# EAGLE design working (EAGLE 6.5.0)
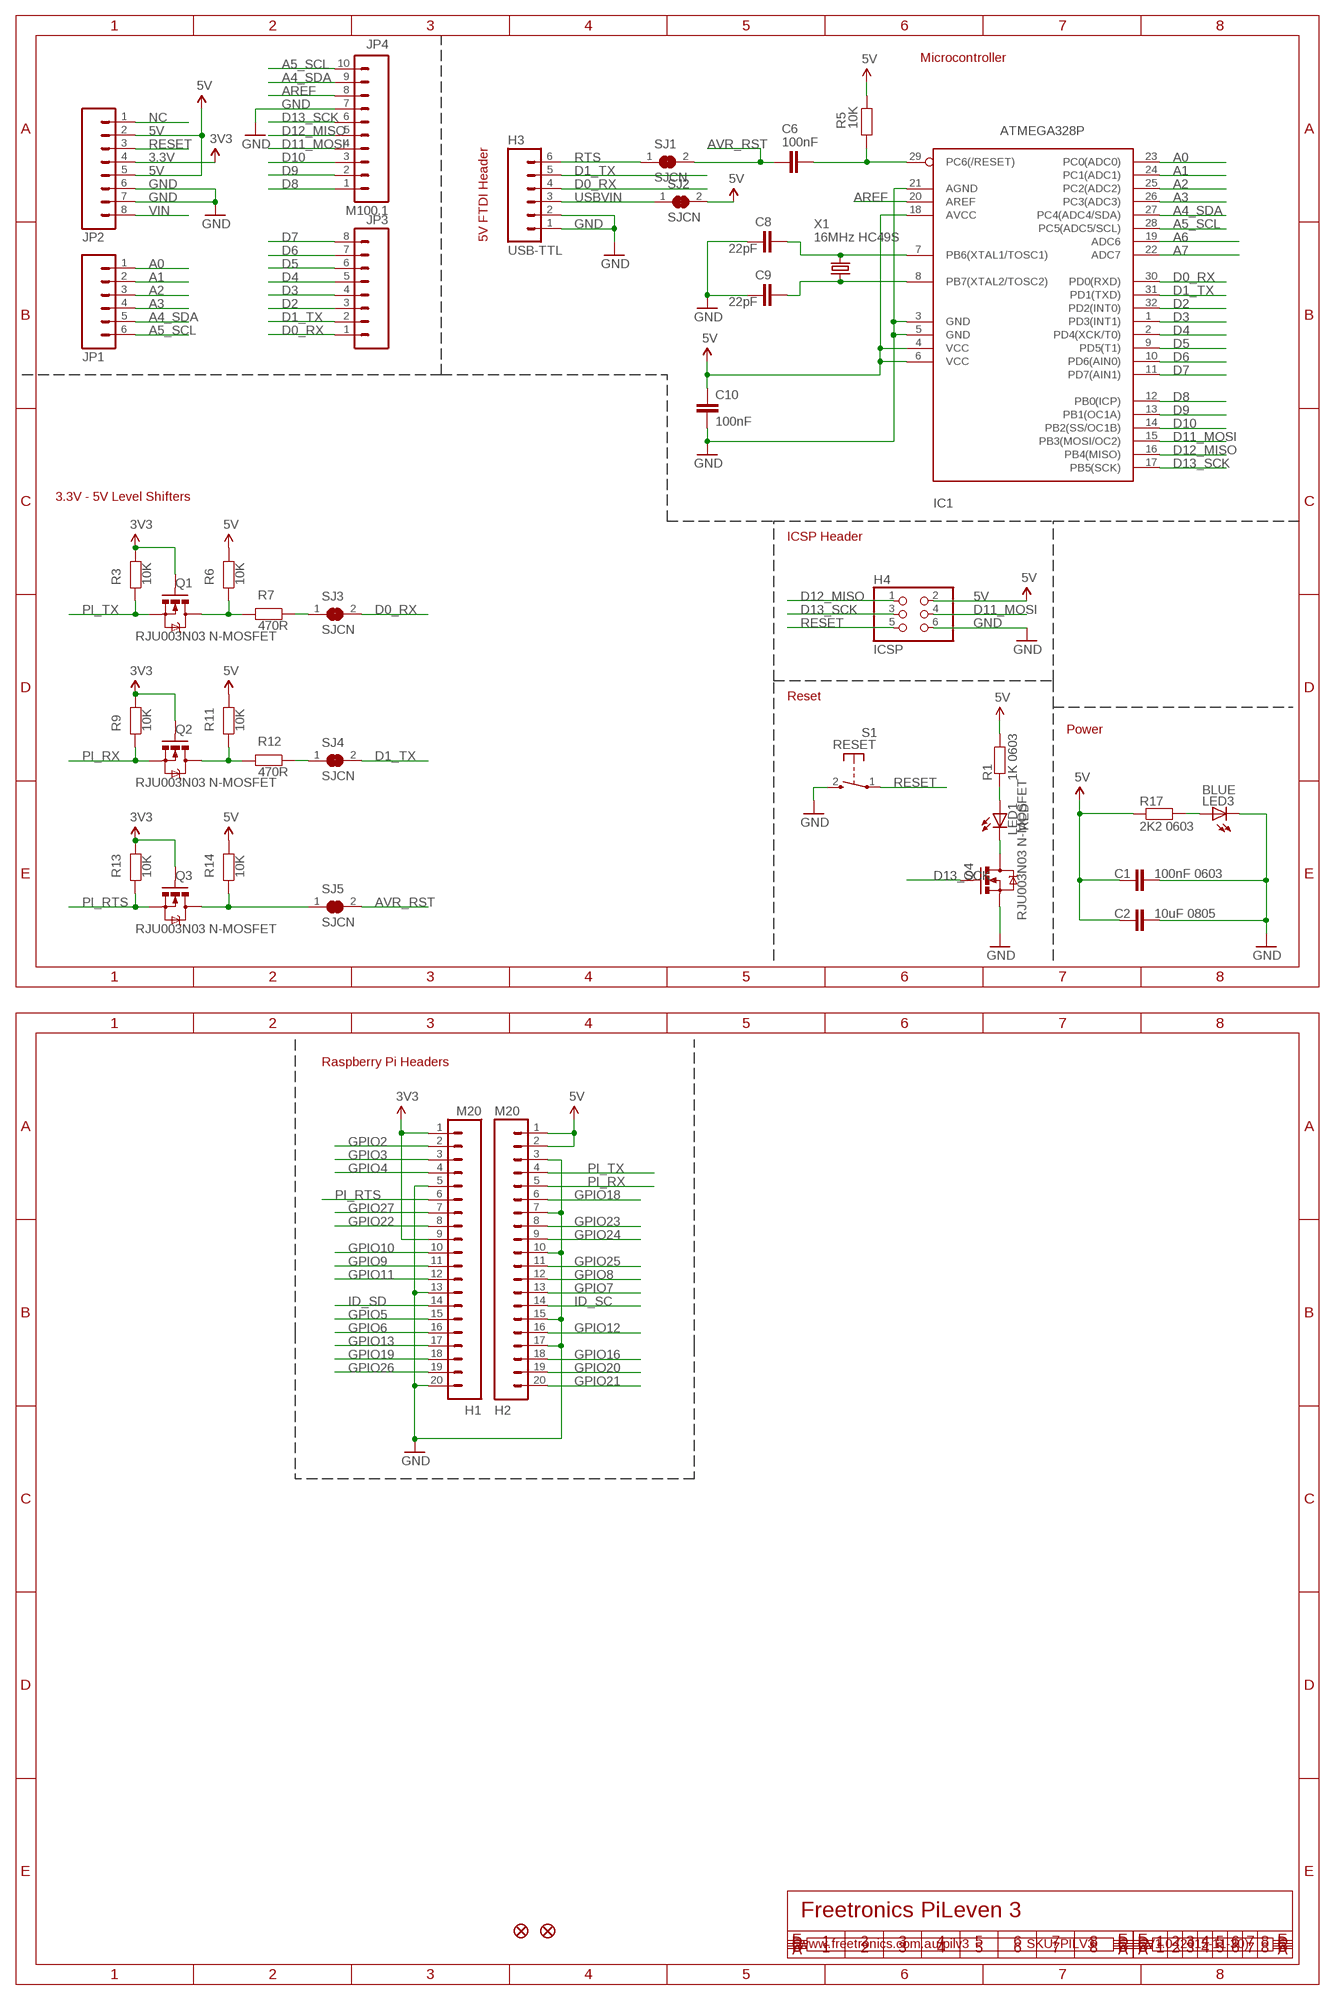
[diagram p0: schematic, sheet 1]

## Parts
C1  100nF 0603  CAP0603  [0603]
C2  10uF 0805  C-EUC0805  [C0805]
C6  100nF  CAP0603  [0603]
C8  22pF  CAP0603  [0603]
C9  22pF  CAP0603  [0603]
C10  100nF  CAP0603  [0603]
H1  M20  [1X20]
H2  M20  [1X20]
H3  USB-TTL  M06SIP  [1X06]
H4  ICSP  PINHD-2X3  [2X03]
IC1  ATMEGA328P  AVR-MEGA8-AI  [TQFP32-08]
JP1  M06SIP  [1X06]
JP2  M08  [1X08]
JP3  M08  [1X08]
JP4  M100.1  [1X10]
LED1  RED  LED0603  [LED-0603]
LED3  BLUE  LED0603  [LED-0603]
Q1  RJU003N03 N-MOSFET  MOSFET-NSOT-323  [SOT32-3]
Q2  RJU003N03 N-MOSFET  MOSFET-NSOT-323  [SOT32-3]
Q3  RJU003N03 N-MOSFET  MOSFET-NSOT-323  [SOT32-3]
Q4  RJU003N03 N-MOSFET  MOSFET-NSOT-323  [SOT32-3]
R1  1K 0603  RESISTOR0603  [0603]
R3  10K  RESISTOR0603  [0603]
R5  10K  RESISTOR0603  [0603]
R6  10K  RESISTOR0603  [0603]
R7  470R  RESISTOR0603  [0603]
R9  10K  RESISTOR0603  [0603]
R11  10K  RESISTOR0603  [0603]
R12  470R  RESISTOR0603  [0603]
R13  10K  RESISTOR0603  [0603]
R14  10K  RESISTOR0603  [0603]
R17  2K2 0603  RESISTOR0603  [0603]
S1  RESET  TAC_SWITCH_2PIN  [TACTILE_SWITCH_SMD_2PIN_TINY]
SJ1  SJCN  [SJC]
SJ2  SJCN  [SJC]
SJ3  SJCN  [SJC]
SJ4  SJCN  [SJC]
SJ5  SJCN  [SJC]
U$4  FIDUCIAL1X2.5  [FIDUCIAL-1X2.5]
U$5  FIDUCIAL1X2.5  [FIDUCIAL-1X2.5]
X1  16MHz HC49S  CRYSTALHC49UV  [HC49U-V]

## Nets
3.3V: H1.1 H1.9 JP2.4 Q1.1(G) Q2.1(G) Q3.1(G) R3.1 R9.1 R13.1 ; supply symbol labelled 3V3
5V: C1.1 C2.2 C10.1 H2.1 H2.2 H4.2 IC1.4(VCC) IC1.6(VCC) IC1.18(AVCC) JP2.2 JP2.5 R1.2 R5.2 R6.1 R11.1 R14.1 R17.1 SJ2.2
A0: IC1.23(PC0(ADC0)) JP1.1
A1: IC1.24(PC1(ADC1)) JP1.2
A2: IC1.25(PC2(ADC2)) JP1.3
A3: IC1.26(PC3(ADC3)) JP1.4
A4_SDA: IC1.27(PC4(ADC4/SDA)) JP1.5 JP4.9
A5_SCL: IC1.28(PC5(ADC5/SCL)) JP1.6 JP4.10
A6: IC1.19(ADC6)
A7: IC1.22(ADC7)
AREF: IC1.20(AREF) JP4.8
AVR_RST: C6.1 SJ1.2 SJ5.2
D0_RX: H3.4 IC1.30(PD0(RXD)) JP3.1 SJ3.2
D1_TX: H3.5 IC1.31(PD1(TXD)) JP3.2 SJ4.2
D2: IC1.32(PD2(INT0)) JP3.3
D3: IC1.1(PD3(INT1)) JP3.4
D4: IC1.2(PD4(XCK/T0)) JP3.5
D5: IC1.9(PD5(T1)) JP3.6
D6: IC1.10(PD6(AIN0)) JP3.7
D7: IC1.11(PD7(AIN1)) JP3.8
D8: IC1.12(PB0(ICP)) JP4.1
D9: IC1.13(PB1(OC1A)) JP4.2
D10: IC1.14(PB2(SS/OC1B)) JP4.3
D11_MOSI: H4.4 IC1.15(PB3(MOSI/OC2)) JP4.4
D12_MISO: H4.1 IC1.16(PB4(MISO)) JP4.5
D13_SCK: H4.3 IC1.17(PB5(SCK)) JP4.6 Q4.1(G)
GND: C1.2 C2.1 C8.1 C9.1 C10.2 H1.5 H1.13 H1.20 H2.3 H2.7 H2.10 H2.15 H2.17 H3.1 H3.2 H4.6 IC1.3(GND) IC1.5(GND) IC1.21(AGND) JP2.6 JP2.7 JP4.7 LED3.C Q4.2(S) S1.2(S)
GPIO2: H1.2
GPIO3: H1.3
GPIO4: H1.4
GPIO5: H1.15
GPIO6: H1.16
GPIO7: H2.13
GPIO8: H2.12
GPIO9: H1.11
GPIO10: H1.10
GPIO11: H1.12
GPIO12: H2.16
GPIO13: H1.17
GPIO16: H2.18
GPIO18: H2.6
GPIO19: H1.18
GPIO20: H2.19
GPIO21: H2.20
GPIO22: H1.8
GPIO23: H2.8
GPIO24: H2.9
GPIO25: H2.11
GPIO26: H1.19
GPIO27: H1.7
ID_SC: H2.14
ID_SD: H1.14
N$1: LED3.A R17.2
N$2: Q1.3(D) R6.2 R7.2
N$3: R7.1 SJ3.1
N$4: R12.1 SJ4.1
N$5: C8.2 IC1.7(PB6(XTAL1/TOSC1)) X1.2
N$7: Q2.3(D) R11.2 R12.2
N$8: Q3.3(D) R14.2 SJ5.1
N$9: LED1.C Q4.3(D)
N$10: LED1.A R1.1
N$50: C9.2 IC1.8(PB7(XTAL2/TOSC2)) X1.1
NC: JP2.1
PI_RTS: H1.6 Q3.2(S) R13.2
PI_RX: H2.5 Q2.2(S) R9.2
PI_TX: H2.4 Q1.2(S) R3.2
RESET: C6.2 H4.5 IC1.29(PC6(/RESET)) JP2.3 R5.1 S1.1(P)
RTS: H3.6 SJ1.1
USBVIN: H3.3 SJ2.1
VIN: JP2.8

## Notes on the sheet
- Microcontroller
- 5V FTDI Header
- 3.3V - 5V Level Shifters
- ICSP Header
- Reset
- Power
- Raspberry Pi Headers
- Freetronics PiLeven 3
- www.freetronics.com.au/pilv3 | SKU: PILV3 | V1.0 (2015-11-30)

## Library data of the parts
C1 = freetronics:CAP: Capacitor Standard 0603 ceramic capacitor, and 0.1" leaded capacitor.
C2 = freetronics-jon:C-EU: CAPACITOR, European symbol
C6 C8-C10 = freetronics-master-v1.1:CAP: Capacitor Standard 0603 ceramic capacitor, and 0.1" leaded capacitor.
H1 H2 = freetronics-master-v1:M20: This is just like the LOCK variant in that the holes are staggared by 5 mil, but except for the last two holes. They are not altered from the "standard" footprint layout. This is used for a special purpose on the layout of our Graphic LCD Backpack. Make sure you want to use this device before selecting it for you project!
H3 = freetronics:M06: Header 6 Standard 6-pin 0.1" header. Use with straight break away headers (SKU : PRT-00116), right angle break away headers (PRT-00553), swiss pins (PRT-00743), machine pins (PRT-00117), and female headers (PRT-00115). Molex polarized connector foot print use with SKU : PRT-08094 with associated crimp pins and housings. NOTES ON THE VARIANTS LOCK and LOCK_LONGPADS... This footprint was designed to help hold the alignment of a through-hole component (i.e. 6-pin header) while soldering it into place. You may notice that each hole has been shifted either up or down by 0.005 of an inch from it's more standard position (which is a perfectly straight line). This slight alteration caused the pins (the squares in the middle) to touch the edges of the holes. Because they are alternating, it causes a "brace" to hold the component in place. 0.005 has proven to be the perfect amount of "off-center" position when using our standard breakaway headers. Although looks a little odd when you look at the bare footprint, once you have a header in there, the alteration is very hard to notice. Also, if you push a header all the way into place, it is covered up entirely on the bottom side. This idea of altering the position of holes to aid alignment will be further integrated into the Sparkfun Library for other footprints. It can help hold any component with 3 or more connection pins.
H4 = pinhead:PINHD-2X3: PIN HEADER
IC1 = freetronics-master-v1.1:AVR-MEGA8: MICROCONTROLLER 8 Kbytes FLASH 1 kbytes SRAM 512 bytes EEPROM USART 6-channel 10 bit ADC 2-channel 8 bit ADC
JP1 = freetronics-original:M06: Header 6 Standard 6-pin 0.1" header. Use with straight break away headers (SKU : PRT-00116), right angle break away headers (PRT-00553), swiss pins (PRT-00743), machine pins (PRT-00117), and female headers (PRT-00115). Molex polarized connector foot print use with SKU : PRT-08094 with associated crimp pins and housings. NOTES ON THE VARIANTS LOCK and LOCK_LONGPADS... This footprint was designed to help hold the alignment of a through-hole component (i.e. 6-pin header) while soldering it into place. You may notice that each hole has been shifted either up or down by 0.005 of an inch from it's more standard position (which is a perfectly straight line). This slight alteration caused the pins (the squares in the middle) to touch the edges of the holes. Because they are alternating, it causes a "brace" to hold the component in place. 0.005 has proven to be the perfect amount of "off-center" position when using our standard breakaway headers. Although looks a little odd when you look at the bare footprint, once you have a header in there, the alteration is very hard to notice. Also, if you push a header all the way into place, it is covered up entirely on the bottom side. This idea of altering the position of holes to aid alignment will be further integrated into the Sparkfun Library for other footprints. It can help hold any component with 3 or more connection pins.
JP2 JP3 = freetronics-original:M08: Header 8 Standard 8-pin 0.1" header. Use with straight break away headers (SKU : PRT-00116), right angle break away headers (PRT-00553), swiss pins (PRT-00743), machine pins (PRT-00117), and female headers (PRT-00115).
JP4 = freetronics-original:M10: Header 10 Standard 10-pin 0.1" header. Use with straight break away headers (SKU : PRT-00116), right angle break away headers (PRT-00553), swiss pins (PRT-00743), machine pins (PRT-00117), and female headers (PRT-00115).
LED1 LED3 = freetronics-jon:LED: LEDs Standard schematic elements and footprints for 5mm, 3mm, 1206, and 0603 sized LEDs. 5mm - Spark Fun Electronics SKU : COM-00529 (and others)
Q1-Q4 = freetronics-jon:MOSFET-N: Basic N-Channel MOSFET
R1 R17 = freetronics-jon:RESISTOR: Resistor Basic schematic elements and footprints for 0603, 1206, and PTH 1/10th watt (small) resistors.
R3 R5-R7 R9 R11-R14 = freetronics-master-v1.1:RESISTOR: Resistor Basic schematic elements and footprints for 0603, 1206, and PTH 1/10th watt (small) resistors.
S1 = freetronics-jon:TAC_SWITCH_2PIN: Momentary Tactile Switch - 2 pin
SJ1-SJ5 = freetronics-jon:SJC
U$4 U$5 = freetronics-original:FIDUCIAL: Fiducial Alignment Points Various fiducial points for machine vision alignment.
X1 = freetronics:CRYSTAL: Crystals Various standard crystals. Proven footprints. Spark Fun Electronics SKU : COM-00534

## Net classes
1 VCC: width 0.305 mm

## Board
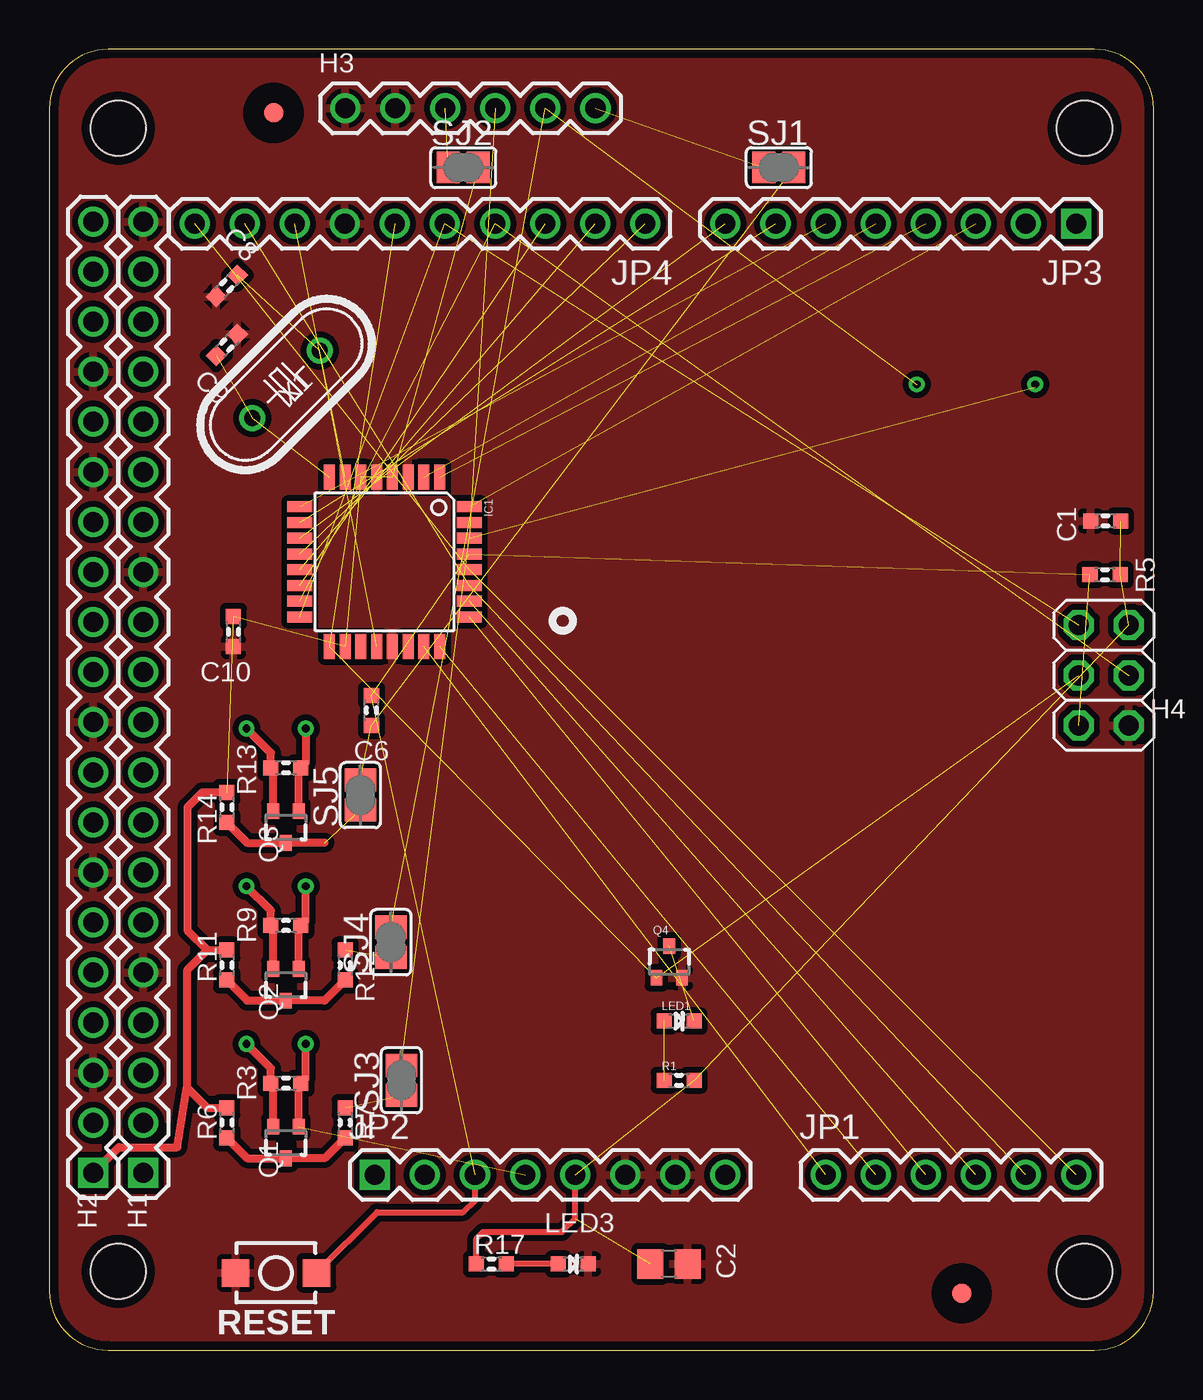
[diagram p1: board, top side]
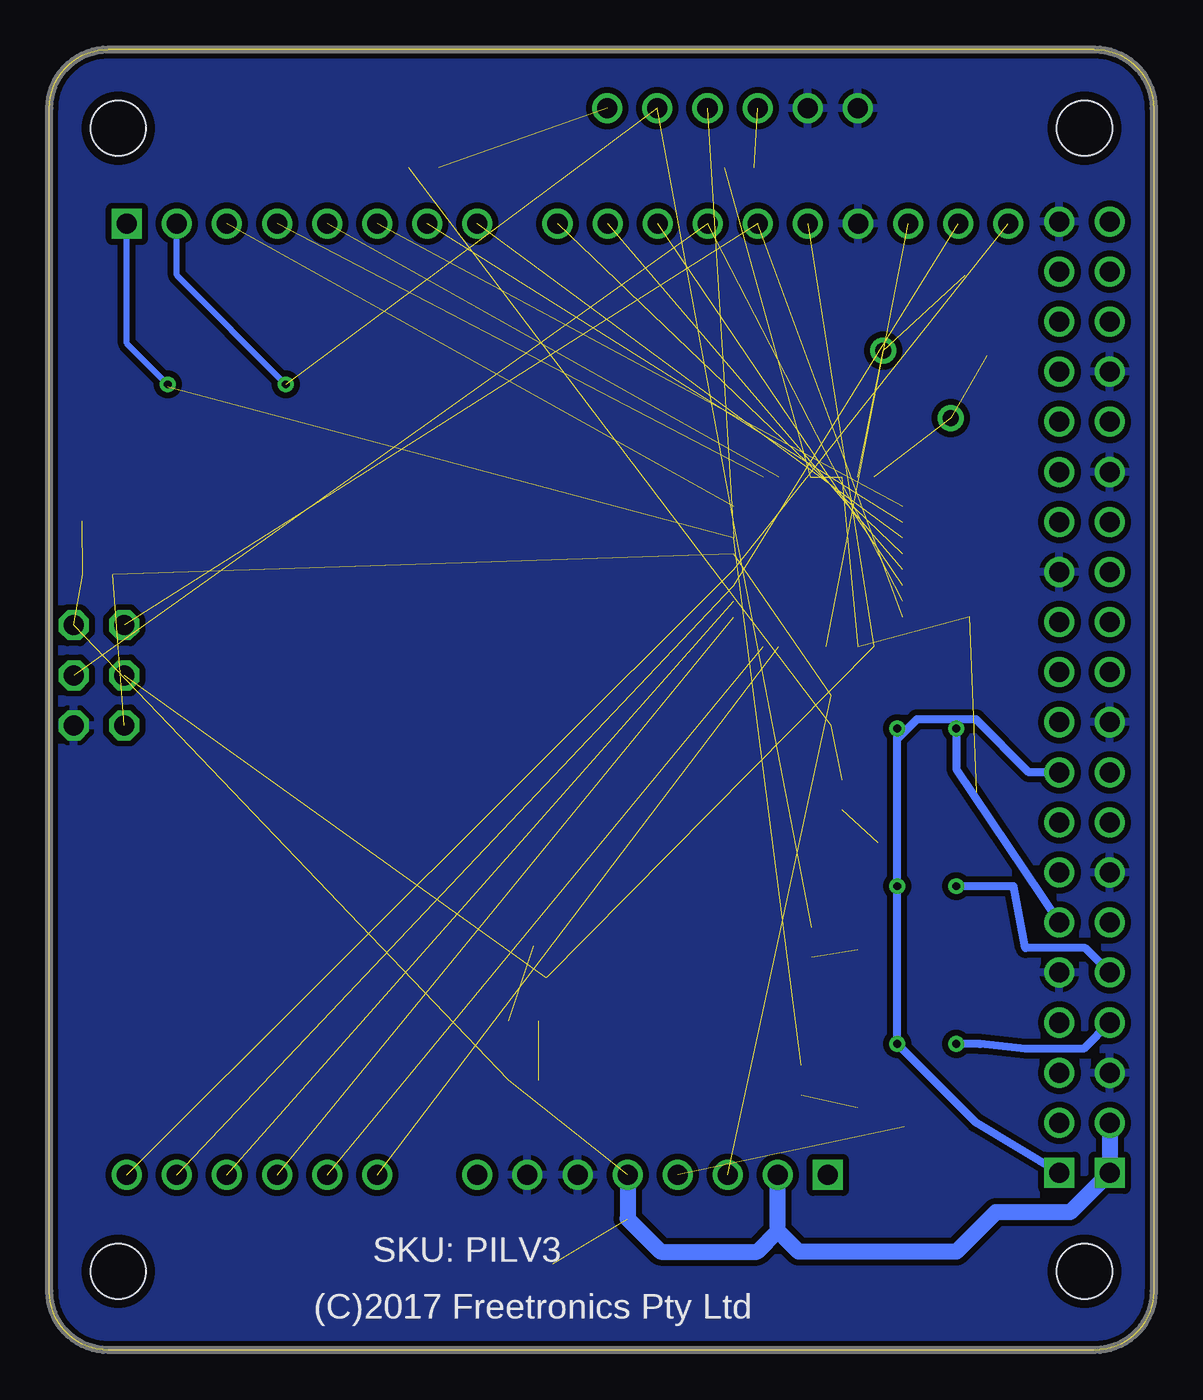
[diagram p2: board, bottom side, seen from below]

Size 56 x 66 mm. Coordinates in mm from the lower left corner, seen from the top.
Outline: 0,3 arc90 3,0 53,0 arc90 56,3 56,63 arc90 53,66 3,66 arc90 0,63 0,3
Copper layers (1*16): Top 0.035mm / dielectric 1.5mm / Bottom 0.035mm
Design rules "default *": minimum track width 10mil, minimum drill 24mil, track to track 12mil, track to pad 12mil, pad to pad 12mil, via to via 12mil, smd to smd 8mil, copper to edge 18mil, drill to drill 8mil, minimum pad ring 10mil, minimum via ring 8mil, stop-mask expansion 4mil, vias tented up to drill 0mil, thermal gap 10mil
Holes 2.8 mm at 52.5,4 52.5,62 3.5,62 3.5,4
tRestrict: area 45.3,1.9 to 47.3,3.9; area 10.4,61.8 to 12.4,63.8

### Footprints (pad centres in the part's own frame; a part is rotated, then mirrored left to right if it is on the bottom)
0603 = smd 0.762 x 0.762: 1 -0.762,0; 2 0.762,0
C0805 = smd 1.3 x 1.5: 1 -0.95,0; 2 0.95,0
1X20 = drill 1.016 square: 1 0,0 | drill 1.016: 2 2.54,0; 3 5.08,0; 4 7.62,0; 5 10.16,0; 6 12.7,0; 7 15.24,0; 8 17.78,0; 9 20.32,0; 10 22.86,0; 11 25.4,0; 12 27.94,0; 13 30.48,0; 14 33.02,0; 15 35.56,0; 16 38.1,0; 17 40.64,0; 18 43.18,0; 19 45.72,0; 20 48.26,0
1X06 = drill 1.016: 1 0,0; 2 2.54,0; 3 5.08,0; 4 7.62,0; 5 10.16,0; 6 12.7,0
2X03 = drill 1.016 octagon: 1 -2.54,-1.27; 2 -2.54,1.27; 3 0,-1.27; 4 0,1.27; 5 2.54,-1.27; 6 2.54,1.27
TQFP32-08 = smd 1.27 x 0.559: 1 -4.293,2.8; 2 -4.293,2; 3 -4.293,1.2; 4 -4.293,0.4; 5 -4.293,-0.4; 6 -4.293,-1.2; 7 -4.293,-2; 8 -4.293,-2.8; 17 4.293,-2.8; 18 4.293,-2; 19 4.293,-1.2; 20 4.293,-0.4; 21 4.293,0.4; 22 4.293,1.2; 23 4.293,2; 24 4.293,2.8 | smd 0.559 x 1.27: 9 -2.8,-4.293; 10 -2,-4.293; 11 -1.2,-4.293; 12 -0.4,-4.293; 13 0.4,-4.293; 14 1.2,-4.293; 15 2,-4.293; 16 2.8,-4.293; 25 2.8,4.293; 26 2,4.293; 27 1.2,4.293; 28 0.4,4.293; 29 -0.4,4.293; 30 -1.2,4.293; 31 -2,4.293; 32 -2.8,4.293
1X08 = drill 1.016 square: 1 0,0 | drill 1.016: 2 2.54,0; 3 5.08,0; 4 7.62,0; 5 10.16,0; 6 12.7,0; 7 15.24,0; 8 17.78,0
1X10 = drill 1.016: 1 0,0; 2 2.54,0; 3 5.08,0; 4 7.62,0; 5 10.16,0; 6 12.7,0; 7 15.24,0; 8 17.78,0; 9 20.32,0; 10 22.86,0
LED-0603 = smd 0.762 x 0.762: A -0.762,0; C 0.762,0
SOT32-3 = smd 0.6 x 0.8: 1 -0.65,-0.8; 2 0.65,-0.8; 3 0,0.8
TACTILE_SWITCH_SMD_2PIN_TINY = smd 1.4 x 1.4: 1 -2.05,0; 2 2.05,0
SJC = smd 1.168 x 1.6: 1 -0.762,0; 2 0.762,0
FIDUCIAL-1X2.5 = smd 1 x 1: 1 0,0
HC49U-V = drill 0.813: 1 -2.413,0; 2 2.413,0

### Placement (x,y rotation side)
C1  53.57,42.07 180 top
C2  31.43,4.38 180 top
C6  16.34,32.46 90 top
C8  9,54 45 top
C9  9,51 225 top
C10  9.34,36.46 270 top
H1  4.77,9 90 top
H2  2.23,9 90 top
H3  15,63 0 top
H4  53.48,34.24 270 top
IC1  17,40 270 top
JP1  39.37,8.89 0 top
JP2  16.51,8.89 0 top
JP3  52.07,57.15 180 top
JP4  30.23,57.15 180 top
LED1  31.94,16.7 0 top
LED3  26.58,4.38 0 top
Q1  12,10.54 180 top
Q2  12,18.54 180 top
Q3  12,26.54 180 top
Q4  31.44,19.7 0 top
R1  31.94,13.7 0 top
R3  12,13.54 180 top
R5  53.54,39.34 0 top
R6  9,11.54 270 top
R7  15,11.54 270 top
R9  12,21.54 180 top
R11  9,19.54 270 top
R12  15,19.54 270 top
R13  12,29.54 180 top
R14  9,27.54 270 top
R17  22.42,4.38 0 top
S1  11.5,3.92 180 top
SJ1  37,60 0 top
SJ2  21,60 0 top
SJ3  17.86,13.7 90 top
SJ4  17.32,20.7 90 top
SJ5  15.78,28.16 90 top
U$4  46.27,2.89 0 top
U$5  11.37,62.77 270 top
X1  12,49 45 top

### Tracks (layer width: path | path; a pad name or v marks a point on that pad's centre or on a via)
3.3V  (via drill 0.4)  (1 unrouted)
  Top 0.305: 12.65,13.54 R3.1 13,13.78 | 12.65,21.54 R9.1 13,21.78 | 12.65,29.54 R13.1 13,29.78
  Top 0.406: Q1.1 12.65,13.54 | Q2.1 12.65,21.54 | Q3.1 12.65,29.54 | 13,13.78 v13,15.54 | 13,21.78 v13,23.54 | v13,31.54 13,29.78
  Bottom 0.406: H1.1 9,11.54 v13,15.54 v13,23.54 v13,31.54 13,31 12,32 9,32 6.32,29.32 H1.9
5V  (10 unrouted)
  Top 0.305: 6.96,13.3 7,13.3 | R17.1 21.66,5.66 22,6 26,6 26.67,6.67 JP2.5
  Top 0.406: 8,20.3 R11.1 | R14.1 7.76,28.3 7,27.54 7,21.3 8,20.3 | H2.1 3.53,10.3 6.5,10.3 6.96,13.3 | R6.1 8,12.3 7,13.3 7,19.3 8,20.3
  Bottom 0.813: H2.2 H2.1 4.23,7 8,7 10,5 18,5 19.05,6.05 | 19.05,6.05 JP2.2 | JP2.5 26.67,6.67 25,5 20.1,5 19.05,6.05
A0  (1 unrouted)
A1  (1 unrouted)
A2  (1 unrouted)
A3  (1 unrouted)
A4_SDA  (2 unrouted)
A5_SCL  (2 unrouted)
AREF  (1 unrouted)
AVR_RST  (2 unrouted)
D0_RX  (via drill 0.4)  (3 unrouted)
  Top 0.305: 50,48.85 v50,49
  Bottom 0.305: v50,49 52.07,51.07 JP3.1
D1_TX  (via drill 0.4)  (3 unrouted)
  Top 0.305: 44,48.85 v44,49
  Bottom 0.305: v44,49 49.53,54.53 JP3.2
D2  (1 unrouted)
D3  (1 unrouted)
D4  (1 unrouted)
D5  (1 unrouted)
D6  (1 unrouted)
D7  (1 unrouted)
D8  (1 unrouted)
D9  (1 unrouted)
D10  (1 unrouted)
D11_MOSI  (2 unrouted)
D12_MISO  (2 unrouted)
D13_SCK  (3 unrouted)
GND
  pour Bottom: 0,3 0,63 arc-90 3,66 53,66 arc-90 56,63 56,3 arc-90 53,0 3,0 arc-90
  pour Top: 0,3 0,63 arc-90 3,66 53,66 arc-90 56,63 56,3 arc-90 53,0 3,0 arc-90
N$1
  Top 0.305: LED3.A R17.2
N$2
  Top 0.406: R6.2 10.04,9.74 Q1.3 13.96,9.74 R7.2
N$3  (1 unrouted)
N$4  (1 unrouted)
N$5  (2 unrouted)
N$7
  Top 0.406: R12.2 13.96,17.74 Q2.3 10.04,17.74 R11.2
N$8  (1 unrouted)
  Top 0.406: 13.96,25.74 Q3.3 10.04,25.74 R14.2
N$9  (1 unrouted)
N$10  (1 unrouted)
N$50  (2 unrouted)
PI_RTS  (via drill 0.4)
  Top 0.305: 11.35,29.54 R13.2
  Top 0.406: Q3.2 11.35,29.54 | R13.2 11.24,30.3 v10,31.54
  Bottom 0.406: v10,31.54 10,29.47 H1.6
PI_RX  (via drill 0.4)
  Top 0.305: 11.35,21.54 R9.2
  Top 0.406: Q2.2 11.35,21.54 | R9.2 11.24,22.3 v10,23.54
  Bottom 0.406: H2.5 3.47,20.4 6.5,20.4 7.1,23.54 v10,23.54
PI_TX  (via drill 0.4)
  Top 0.406: Q1.2 11.35,13.54 R3.2 11.24,14.3 v10,15.54
  Bottom 0.406: H2.4 3.55,15.3 6.5,15.3 8.8,15.54 v10,15.54
RESET  (4 unrouted)
  Top 0.305: S1.1 16.63,7 21,7 21.59,7.59 JP2.3
RTS  (1 unrouted)
USBVIN  (1 unrouted)

### Text on the board
tPlace: v1.0 | 1 | FTDI | 6 | USB-Serial | BLK | GRN | RESET
bPlace: D0: Serial RX / D1: Serial TX / D5: RF TX data / D6: RF TX LED / D7: RF RX LED / D8: RF RX data | Building Brain v1.0 | www.superhouse.tv/brain | SKU: PILV3 | (C)2017 Freetronics Pty Ltd